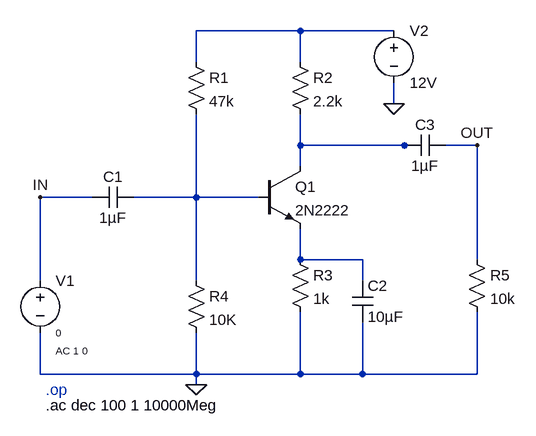
[diagram p0: schematic schematic.asc]
schematic.asc, the LTspice schematic file:
Version 4.1
SHEET 1 880 680
WIRE 464 -352 304 -352
WIRE 608 -352 464 -352
WIRE 304 -304 304 -352
WIRE 464 -304 464 -352
WIRE 608 -240 608 -272
WIRE 464 -176 464 -224
WIRE 624 -176 464 -176
WIRE 640 -176 624 -176
WIRE 736 -176 688 -176
WIRE 464 -144 464 -176
WIRE 144 -96 64 -96
WIRE 304 -96 304 -224
WIRE 304 -96 208 -96
WIRE 400 -96 304 -96
WIRE 464 0 464 -48
WIRE 560 0 464 0
WIRE 736 0 736 -176
WIRE 64 32 64 -96
WIRE 304 32 304 -96
WIRE 560 32 560 0
WIRE 64 176 64 112
WIRE 304 176 304 112
WIRE 304 176 64 176
WIRE 464 176 464 80
WIRE 464 176 304 176
WIRE 560 176 560 96
WIRE 560 176 464 176
WIRE 736 176 736 80
WIRE 736 176 560 176
WIRE 304 192 304 176
FLAG 304 192 0
FLAG 608 -240 0
FLAG 64 -96 IN
FLAG 736 -176 OUT
SYMBOL voltage 64 16 R0
WINDOW 3 24 96 Left 1
WINDOW 123 24 124 Left 1
WINDOW 39 0 0 Left 0
SYMATTR InstName V1
SYMATTR Value 0
SYMATTR Value2 AC 1 0
SYMBOL cap 208 -112 R90
WINDOW 0 0 32 VBottom 2
WINDOW 3 32 32 VTop 2
SYMATTR InstName C1
SYMATTR Value 1µF
SYMBOL res 288 -320 R0
SYMATTR InstName R1
SYMATTR Value 47k
SYMBOL res 448 -320 R0
SYMATTR InstName R2
SYMATTR Value 2.2k
SYMBOL npn 400 -144 R0
SYMATTR InstName Q1
SYMATTR Value 2N2222
SYMBOL cap 544 32 R0
SYMATTR InstName C2
SYMATTR Value 10µF
SYMBOL res 448 -16 R0
SYMATTR InstName R3
SYMATTR Value 1k
SYMBOL res 288 16 R0
SYMATTR InstName R4
SYMATTR Value 10K
SYMBOL voltage 608 -368 R0
SYMATTR InstName V2
SYMATTR Value 12V
SYMBOL cap 688 -192 R90
WINDOW 0 0 32 VBottom 2
WINDOW 3 32 32 VTop 2
SYMATTR InstName C3
SYMATTR Value 1µF
SYMBOL res 720 -16 R0
SYMATTR InstName R5
SYMATTR Value 10k
TEXT 72 200 Left 2 ;.op
TEXT 72 224 Left 2 !.ac dec 100 1 10000Meg

The netlist it stands for:
* schematic.asc
V1 IN 0 0 AC 1 0
C1 N003 IN 1µF
R1 N001 N003 47k
R2 N001 N002 2.2k
Q1 N002 N003 N004 0 2N2222
C2 N004 0 10µF
R3 N004 0 1k
R4 N003 0 10K
V2 N001 0 12V
C3 OUT N002 1µF
R5 OUT 0 10k
.model NPN NPN
.model PNP PNP
.lib standard.bjt
* .op
.ac dec 100 1 10000Meg
.backanno
.end